# Altium schematic sheet Basic_Logic_gates.SchDoc
size A3
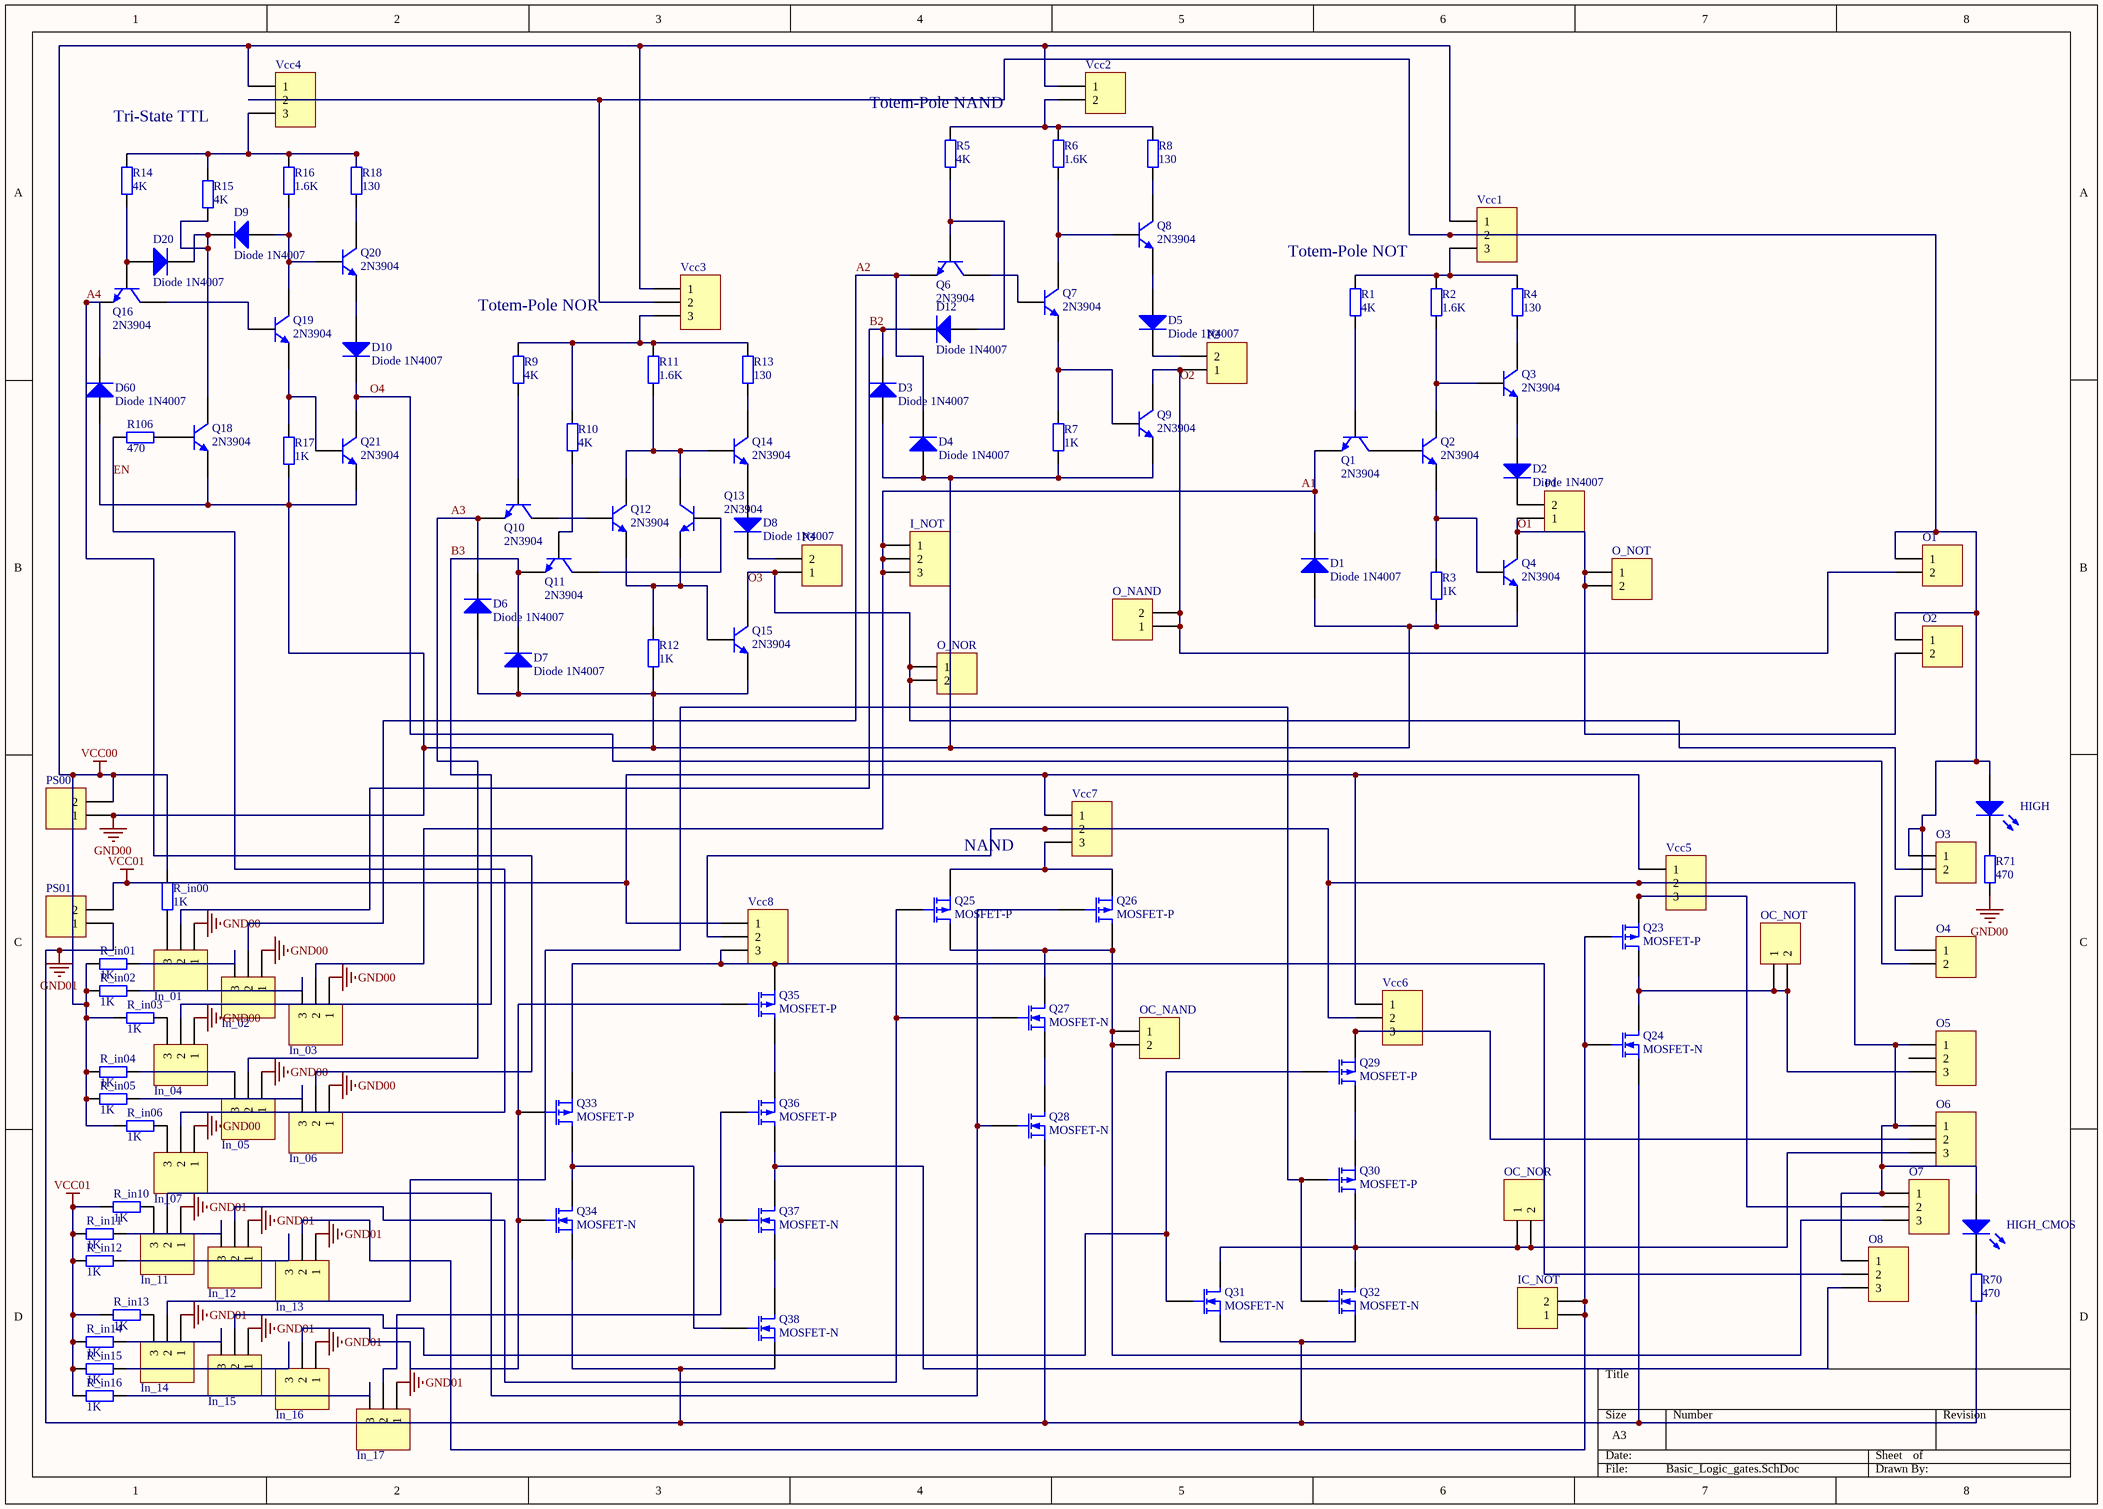
[diagram p0: Basic_Logic_gates.SchDoc]

## Parts
D1  Diode 1N4007  [DO-41]
D2  Diode 1N4007  [DO-41]
D3  Diode 1N4007  [DO-41]
D4  Diode 1N4007  [DO-41]
D5  Diode 1N4007  [DO-41]
D6  Diode 1N4007  [DO-41]
D7  Diode 1N4007  [DO-41]
D8  Diode 1N4007  [DO-41]
D9  Diode 1N4007  [DO-41]
D10  Diode 1N4007  [DO-41]
D12  Diode 1N4007  [DO-41]
D20  Diode 1N4007  [DO-41]
D60  Diode 1N4007  [DO-41]
HIGH  LED0  [LED-0]  (value not drawn)
HIGH_CMOS  LED0  [LED-0]  (value not drawn)
I_NOT  Header 3  [HDR1X3]  (value not drawn)
IC_NOT  Header 2  [HDR1X2]  (value not drawn)
In_01  Header 3  [HDR1X3]  (value not drawn)
In_02  Header 3  [HDR1X3]  (value not drawn)
In_03  Header 3  [HDR1X3]  (value not drawn)
In_04  Header 3  [HDR1X3]  (value not drawn)
In_05  Header 3  [HDR1X3]  (value not drawn)
In_06  Header 3  [HDR1X3]  (value not drawn)
In_07  Header 3  [HDR1X3]  (value not drawn)
In_11  Header 3  [HDR1X3]  (value not drawn)
In_12  Header 3  [HDR1X3]  (value not drawn)
In_13  Header 3  [HDR1X3]  (value not drawn)
In_14  Header 3  [HDR1X3]  (value not drawn)
In_15  Header 3  [HDR1X3]  (value not drawn)
In_16  Header 3  [HDR1X3]  (value not drawn)
In_17  Header 3  [HDR1X3]  (value not drawn)
O1  Header 2  [HDR1X2]  (value not drawn)
O2  Header 2  [HDR1X2]  (value not drawn)
O3  Header 2  [HDR1X2]  (value not drawn)
O4  Header 2  [HDR1X2]  (value not drawn)
O5  Header 3  [HDR1X3]  (value not drawn)
O6  Header 3  [HDR1X3]  (value not drawn)
O7  Header 3  [HDR1X3]  (value not drawn)
O8  Header 3  [HDR1X3]  (value not drawn)
O_NAND  Header 2  [HDR1X2]  (value not drawn)
O_NOR  Header 2  [HDR1X2]  (value not drawn)
O_NOT  Header 2  [HDR1X2]  (value not drawn)
OC_NAND  Header 2  [HDR1X2]  (value not drawn)
OC_NOR  Header 2  [HDR1X2]  (value not drawn)
OC_NOT  Header 2  [HDR1X2]  (value not drawn)
P1  Header 2  [HDR1X2]  (value not drawn)
P2  Header 2  [HDR1X2]  (value not drawn)
P3  Header 2  [HDR1X2]  (value not drawn)
PS00  Header 2  [HDR1X2]  (value not drawn)
PS01  Header 2  [HDR1X2]  (value not drawn)
Q1  2N3904  [TO-92A]
Q2  2N3904  [TO-92A]
Q3  2N3904  [TO-92A]
Q4  2N3904  [TO-92A]
Q6  2N3904  [TO-92A]
Q7  2N3904  [TO-92A]
Q8  2N3904  [TO-92A]
Q9  2N3904  [TO-92A]
Q10  2N3904  [TO-92A]
Q11  2N3904  [TO-92A]
Q12  2N3904  [TO-92A]
Q13  2N3904  [TO-92A]
Q14  2N3904  [TO-92A]
Q15  2N3904  [TO-92A]
Q16  2N3904  [TO-92A]
Q18  2N3904  [TO-92A]
Q19  2N3904  [TO-92A]
Q20  2N3904  [TO-92A]
Q21  2N3904  [TO-92A]
Q23  MOSFET-P  [E3]
Q24  MOSFET-N  [E3]
Q25  MOSFET-P  [E3]
Q26  MOSFET-P  [E3]
Q27  MOSFET-N  [E3]
Q28  MOSFET-N  [E3]
Q29  MOSFET-P  [E3]
Q30  MOSFET-P  [E3]
Q31  MOSFET-N  [E3]
Q32  MOSFET-N  [E3]
Q33  MOSFET-P  [E3]
Q34  MOSFET-N  [E3]
Q35  MOSFET-P  [E3]
Q36  MOSFET-P  [E3]
Q37  MOSFET-N  [E3]
Q38  MOSFET-N  [E3]
R1  4K  [AXIAL-0.4]
R2  1.6K  [AXIAL-0.4]
R3  1K  [AXIAL-0.4]
R4  130  [AXIAL-0.4]
R5  4K  [AXIAL-0.4]
R6  1.6K  [AXIAL-0.4]
R7  1K  [AXIAL-0.4]
R8  130  [AXIAL-0.4]
R9  4K  [AXIAL-0.4]
R10  4K  [AXIAL-0.4]
R11  1.6K  [AXIAL-0.4]
R12  1K  [AXIAL-0.4]
R13  130  [AXIAL-0.4]
R14  4K  [AXIAL-0.4]
R15  4K  [AXIAL-0.4]
R16  1.6K  [AXIAL-0.4]
R17  1K  [AXIAL-0.4]
R18  130  [AXIAL-0.4]
R70  470  [AXIAL-0.4]
R71  470  [AXIAL-0.4]
R106  470  [AXIAL-0.4]
R_in00  1K  [AXIAL-0.4]
R_in01  1K  [AXIAL-0.4]
R_in02  1K  [AXIAL-0.4]
R_in03  1K  [AXIAL-0.4]
R_in04  1K  [AXIAL-0.4]
R_in05  1K  [AXIAL-0.4]
R_in06  1K  [AXIAL-0.4]
R_in10  1K  [AXIAL-0.4]
R_in11  1K  [AXIAL-0.4]
R_in12  1K  [AXIAL-0.4]
R_in13  1K  [AXIAL-0.4]
R_in14  1K  [AXIAL-0.4]
R_in15  1K  [AXIAL-0.4]
R_in16  1K  [AXIAL-0.4]
Vcc1  Header 3  [HDR1X3]  (value not drawn)
Vcc2  Header 2  [HDR1X2]  (value not drawn)
Vcc3  Header 3  [HDR1X3]  (value not drawn)
Vcc4  Header 3  [HDR1X3]  (value not drawn)
Vcc5  Header 3  [HDR1X3]  (value not drawn)
Vcc6  Header 3  [HDR1X3]  (value not drawn)
Vcc7  Header 3  [HDR1X3]  (value not drawn)
Vcc8  Header 3  [HDR1X3]  (value not drawn)

## Nets
GND00: D1.1(A) D3.1(A) D4.1(A) D6.1(A) D7.1(A) D60.1(A) In_01.1 In_02.1 In_03.1 In_04.1 In_05.1 In_06.1 In_07.1 PS00.1 Q4.1(E) Q9.1(E) Q15.1(E) Q18.1(E) Q21.1(E) R3.1 R7.1 R12.1 R17.1 R71.1
GND01: In_11.1 In_12.1 In_13.1 In_14.1 In_15.1 In_16.1 In_17.1 PS01.1 Q24.3(S) Q28.3(S) Q31.3(S) Q32.3(S) Q34.3(S) Q38.3(S) R70.1
VCC00: PS00.2 R_in00.1 R_in01.1 R_in02.1 R_in03.1 R_in04.1 R_in05.1 R_in06.1 Vcc1.1 Vcc2.1 Vcc3.1 Vcc4.1
VCC01: PS01.2 R_in10.1 R_in11.1 R_in12.1 R_in13.1 R_in14.1 R_in15.1 R_in16.1 Vcc5.1 Vcc6.1 Vcc7.1 Vcc8.1
A1: D1.2(K) I_NOT.1 I_NOT.2 I_NOT.3 In_03.2 Q1.1(E)
A2: D4.2(K) In_02.2 Q6.1(E)
A3: D6.2(K) In_05.2 Q10.1(E)
A4: D60.2(K) In_06.2 Q16.1(E)
B2: D3.2(K) D12.2(K) In_01.2
B3: D7.2(K) In_04.2 Q11.1(E)
EN: In_07.2 R106.2
O1: O2.2 O_NOT.1 O_NOT.2 P1.1 Q4.3(C)
O2: O1.2 O_NAND.1 O_NAND.2 P2.1 Q9.3(C)
O3: O3.2 O_NOR.1 O_NOR.2 P3.1 Q15.3(C)
O4: D10.2(K) O4.2 Q21.3(C)
NetD2_1: D2.1(A) Q3.1(E)
NetD2_2: D2.2(K) P1.2
NetD5_1: D5.1(A) Q8.1(E)
NetD5_2: D5.2(K) P2.2
NetD8_1: D8.1(A) Q14.1(E)
NetD8_2: D8.2(K) P3.2
NetD9_1: D9.1(A) Q19.3(C) Q20.2(B) R16.1
NetD9_2: D9.2(K) D20.2(K) Q18.3(C) R15.1
NetD10_1: D10.1(A) Q20.1(E)
NetD12_1: D12.1(A) Q6.2(B) R5.1
NetD20_1: D20.1(A) Q16.2(B) R14.1
NetHIGH_1: HIGH.1(A) O1.1 O2.1 O3.1 O4.1 Vcc1.2 Vcc3.2 Vcc4.2
NetHIGH_2: HIGH.2(K) R71.2
NetHIGH_CMOS_1: HIGH_CMOS.1(A) O5.1 O6.1 O7.1 O8.1 Vcc5.2 Vcc6.2 Vcc7.2 Vcc8.2
NetHIGH_CMOS_2: HIGH_CMOS.2(K) R70.2
NetIC_NOT_1: IC_NOT.1 IC_NOT.2 In_13.2 Q23.2(G) Q24.2(G)
NetIn_01_3: In_01.3 R_in00.2
NetIn_02_3: In_02.3 R_in01.2
NetIn_03_3: In_03.3 R_in02.2
NetIn_04_3: In_04.3 R_in03.2
NetIn_05_3: In_05.3 R_in04.2
NetIn_06_3: In_06.3 R_in05.2
NetIn_07_3: In_07.3 R_in06.2
NetIn_11_2: In_11.2 Q26.2(G) Q28.2(G)
NetIn_11_3: In_11.3 R_in10.2
NetIn_12_2: In_12.2 Q25.2(G) Q27.2(G)
NetIn_12_3: In_12.3 R_in11.2
NetIn_13_3: In_13.3 R_in12.2
NetIn_14_2: In_14.2 Q30.2(G) Q32.2(G)
NetIn_14_3: In_14.3 R_in13.2
NetIn_15_2: In_15.2 Q29.2(G) Q31.2(G)
NetIn_15_3: In_15.3 R_in14.2
NetIn_16_2: In_16.2 Q33.2(G) Q34.2(G) Q35.2(G)
NetIn_16_3: In_16.3 R_in15.2
NetIn_17_2: In_17.2 Q36.2(G) Q37.2(G)
NetIn_17_3: In_17.3 R_in16.2
NetO5_3: O5.3 OC_NOT.1 OC_NOT.2 Q23.1(D) Q24.1(D)
NetO6_2: O6.2 Q29.3(S) Vcc6.3
NetO6_3: O6.3 OC_NOR.1 OC_NOR.2 Q30.1(D) Q31.1(D) Q32.1(D)
NetO7_2: O7.2 Q23.3(S) Vcc5.3
NetO7_3: O7.3 OC_NAND.1 OC_NAND.2 Q25.1(D) Q26.1(D) Q27.1(D)
NetO8_2: O8.2 Q33.3(S) Q35.3(S) Vcc8.3
NetO8_3: O8.3 Q36.1(D) Q37.1(D)
NetQ1_2: Q1.2(B) R1.1
NetQ1_3: Q1.3(C) Q2.2(B)
NetQ2_1: Q2.1(E) Q4.2(B) R3.2
NetQ2_3: Q2.3(C) Q3.2(B) R2.1
NetQ3_3: Q3.3(C) R4.1
NetQ6_3: Q6.3(C) Q7.2(B)
NetQ7_1: Q7.1(E) Q9.2(B) R7.2
NetQ7_3: Q7.3(C) Q8.2(B) R6.1
NetQ8_3: Q8.3(C) R8.1
NetQ10_2: Q10.2(B) R9.1
NetQ10_3: Q10.3(C) Q12.2(B)
NetQ11_2: Q11.2(B) R10.1
NetQ11_3: Q11.3(C) Q13.2(B)
NetQ12_1: Q12.1(E) Q13.1(E) Q15.2(B) R12.2
NetQ12_3: Q12.3(C) Q13.3(C) Q14.2(B) R11.1
NetQ14_3: Q14.3(C) R13.1
NetQ16_3: Q16.3(C) Q19.2(B)
NetQ18_2: Q18.2(B) R106.1
NetQ19_1: Q19.1(E) Q21.2(B) R17.2
NetQ20_3: Q20.3(C) R18.1
NetQ25_3: Q25.3(S) Q26.3(S) Vcc7.3
NetQ27_3: Q27.3(S) Q28.1(D)
NetQ29_1: Q29.1(D) Q30.3(S)
NetQ33_1: Q33.1(D) Q34.1(D) Q38.2(G)
NetQ35_1: Q35.1(D) Q36.3(S)
NetQ37_3: Q37.3(S) Q38.1(D)
NetR1_2: R1.2 R2.2 R4.2 Vcc1.3
NetR5_2: R5.2 R6.2 R8.2 Vcc2.2
NetR9_2: R9.2 R10.2 R11.2 R13.2 Vcc3.3
NetR14_2: R14.2 R15.2 R16.2 R18.2 Vcc4.3

Not connected (* = marked no-connect by the designer): O5 2

## Notes on the sheet
- (near R5) Totem-Pole NAND
- Tri-State TTL
- (near R9) Totem-Pole NOR
- Totem-Pole NOT
- (near Q25) NAND

## Library data of the parts
D1-D10 D12 D20 D60 = Diode 1N4007: 1 Amp General Purpose Rectifier; Published: 8-Jun-2000; LatestRevisionDate: 17-Jul-2002; LatestRevisionNote: Re-released for DXP Platform.; DatasheetVersion: 1998; PackageVersion: Aug-1999; PackageReference: DO-41; Publisher: Altium Limited; PackageDescription: Diode, Axial; Body 5.2 x 2.7 mm (LxDia. max), Lead Dia. 0.86 mm (max); Code_JEDEC: DO-204-AL; ComponentLink1Description: Manufacturer Link; ComponentLink1URL: http://www.fairchildsemi.com/; ComponentLink2Description: Datasheet; ComponentLink2URL: http://www.fairchildsemi.com/ds/1N%2F1N4001.pdf
HIGH HIGH_CMOS = LED0: Typical INFRARED GaAs LED; Published: 8-Jun-2000; LatestRevisionDate: 08-Jul-2005; LatestRevisionNote: Mech Layer 1 removed.; PackageReference: LED-0; Publisher: Altium Limited; PackageDescription: LED; 2 Leads
I_NOT In_01 In_02 In_03 In_04 In_05 In_06 In_07 In_11-In_17 O5-O8 Vcc1 Vcc3-Vcc8 = Header 3: Header, 3-Pin; LatestRevisionDate: 17-Jul-2002; LatestRevisionNote: Re-released for DXP Platform.; Publisher: Altium Limited
IC_NOT O1-O4 O_NAND O_NOR O_NOT OC_NAND OC_NOR OC_NOT P1-P3 PS00 PS01 Vcc2 = Header 2: Header, 2-Pin; LatestRevisionDate: 17-Jul-2002; LatestRevisionNote: Re-released for DXP Platform.; Publisher: Altium Limited
Q1-Q4 Q6-Q16 Q18-Q21 = 2N3904: NPN General Purpose Amplifier; Published: 8-Jun-2000; LatestRevisionDate: 15-Jan-2003; LatestRevisionNote: PCB Footprint 'BCY-W3/D4.7' replaced; DatasheetVersion: 1997; PackageVersion: Sep-1998; PackageReference: TO-92A; Publisher: Altium Limited; PackageDescription: TO, Flat Index; 3 In-Line, Axial Leads; Body Dia. 4.5mm; Leads 0.51 x 0.48 mm (max); ComponentLink1Description: Manufacturer Link; ComponentLink1URL: http://www.fairchildsemi.com/; ComponentLink2Description: Datasheet; ComponentLink2URL: http://www.fairchildsemi.com/ds/2N%2F2N3904.pdf
Q23 Q25 Q26 Q29 Q30 Q33 Q35 Q36 = MOSFET-P: P-Channel MOSFET; Published: 8-Jun-2000; LatestRevisionDate: 17-Jul-2002; LatestRevisionNote: Re-released for DXP Platform.; PackageVersion: 1995/1996; PackageReference: E3; Publisher: Altium Limited; PackageDescription: TO, Flat Index; 3 In-Line, Axial Leads; Body Dia. 4.6mm; Lead Dia. 0.5 mm (max)
Q24 Q27 Q28 Q31 Q32 Q34 Q37 Q38 = MOSFET-N: N-Channel MOSFET; Published: 8-Jun-2000; LatestRevisionDate: 17-Jul-2002; LatestRevisionNote: Re-released for DXP Platform.; PackageVersion: 1995/1996; PackageReference: E3; Publisher: Altium Limited; PackageDescription: TO, Flat Index; 3 In-Line, Axial Leads; Body Dia. 4.6mm; Lead Dia. 0.5 mm (max)
R1-R18 R70 R71 R106 R_in00 R_in01 R_in02 R_in03 R_in04 R_in05 R_in06 R_in10-R_in16 = Res2: Resistor; Published: 8-Jun-2000; LatestRevisionDate: 17-Jul-2002; LatestRevisionNote: Re-released for DXP Platform.; PackageReference: AXIAL-0.4; Publisher: Altium Limited; PackageDescription: Axial Device, Thru-Hole; 2 Leads; 0.4 in Pin Spacing
  R1 R5 R9 R10 R14 R15: Value: 4K
  R2 R6 R11 R16: Value: 1.6K
  R3 R7 R12 R17 R_in00 R_in01 R_in02 R_in03 R_in04 R_in05 R_in06 R_in10-R_in16: Value: 1K
  R4 R8 R13 R18: Value: 130
  R70 R71 R106: Value: 470